# EAGLE design 1.1 (EAGLE 7.7.0)
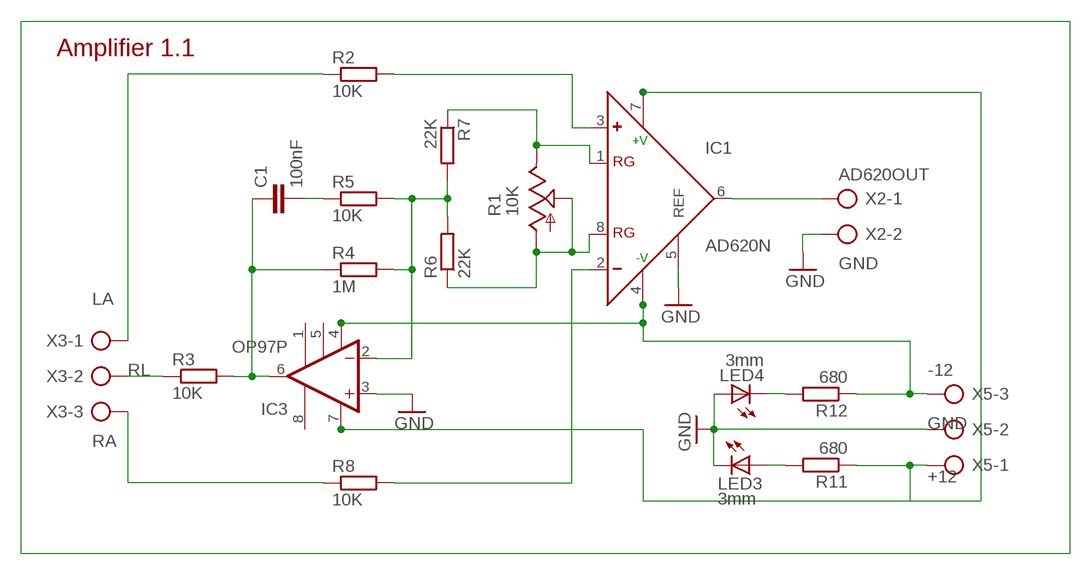
[diagram p0: schematic, sheet 1]

## Parts
C1  100nF  C-EU050-025X075  [C050-025X075]
IC1  AD620N  [DIL08]
IC3  OP97P  [DIL08]
LED3  3mm  LED5MM  [LED5MM]
LED4  3mm  LED5MM  [LED5MM]
R1  10K  TRIM_US-RJ9W  [RJ9W]
R2  10K  R-EU_0207/10  [0207/10]
R3  10K  R-EU_0207/10  [0207/10]
R4  1M  R-EU_0207/10  [0207/10]
R5  10K  R-EU_0207/10  [0207/10]
R6  22K  R-EU_0207/10  [0207/10]
R7  22K  R-EU_0207/10  [0207/10]
R8  10K  R-EU_0207/10  [0207/10]
R11  680  R-EU_0207/10  [0207/10]
R12  680  R-EU_0207/10  [0207/10]
X2  AK500/2-H  [AK500/2-H]
X3  AK500/3-H  [AK500/3-H]
X5  AK500/3-H  [AK500/3-H]

## Nets
+12: IC1.7(+V) IC3.7(V+) R11.1 X5.1
-12: IC1.4(-V) IC3.4(V-) R12.1 X5.3
AD620OUT: IC1.6(OUT) X2.1
GND: IC1.5(REF) IC3.3(+IN) LED3.K(C) LED4.A X2.2 X5.2
LA: R2.1 X3.1
N$1: IC1.1(RG) R1.E R7.1
N$2: IC3.2(-IN) R4.2 R5.2 R6.2 R7.2
N$3: IC1.8(RG) R1.A R1.S R6.1
N$4: C1.2 R5.1
N$5: C1.1 IC3.6(OUT) R3.2 R4.1
N$7: IC1.3(+) R2.2
N$8: IC1.2(-) R8.2
N$17: LED4.K(C) R12.2
N$18: LED3.A R11.2
RA: R8.1 X3.3
RL: R3.1 X3.2
Unconnected: IC3.1(BAL1) IC3.5(COMP) IC3.8(BAL2)

## Notes on the sheet
- Amplifier 1.1

## Library data of the parts
C1 = rcl:C-EU: CAPACITOR, European symbol
IC1 = analog-devices:AD620: Low Cost, Low Power, Instrumentation Amplifier Source: http://www.analog.com/UploadedFiles/Data_Sheets/37793330023930AD620_e.pdf; MF: ALTERA CORPORATION; MPN: AD620AN; OC_FARNELL: 1523782; OC_NEWARK: 05F7108
IC3 = linear:OP97: Low Power, High Precision Operational Amplifier Source: http://www.analog.com/static/imported-files/data_sheets/OP97.pdf
LED3 LED4 = led:LED: LED OSRAM: - CHIPLED LG R971, LG N971, LY N971, LG Q971, LY Q971, LO R971, LY R971 LH N974, LH R974 LS Q976, LO Q976, LY Q976 LO Q996 - Hyper CHIPLED LW Q18S LB Q993, LB Q99A, LB R99A - SideLED LS A670, LO A670, LY A670, LG A670, LP A670 LB A673, LV A673, LT A673, LW A673 LH A674 LY A675 LS A676, LA A676, LO A676, LY A676, LW A676 LS A679, LY A679, LG A679 - Hyper Micro SIDELED® LS Y876, LA Y876, LO Y876, LY Y876 LT Y87S - SmartLED LW L88C, LW L88S LB L89C, LB L89S, LG L890 LS L89K, LO L89K, LY L89K LS L896, LA L896, LO L896, LY L896 - TOPLED LS T670, LO T670, LY T670, LG T670, LP T670 LSG T670, LSP T670, LSY T670, LOP T670, LYG T670 LG T671, LOG T671, LSG T671 LB T673, LV T673, LT T673, LW T673 LH T674 LS T676, LA T676, LO T676, LY T676, LB T676, LH T676, LSB T676, LW T676 LB T67C, LV T67C, LT T67C, LS T67K, LO T67K, LY T67K, LW E67C LS E67B, LA E67B, LO E67B, LY E67B, LB E67C, LV E67C, LT E67C LW T67C LS T679, LY T679, LG T679 LS T770, LO T770, LY T770, LG T770, LP T770 LB T773, LV T773, LT T773, LW T773 LH T774 LS E675, LA E675, LY E675, LS T675 LS T776, LA T776, LO T776, LY T776, LB T776 LHGB T686 LT T68C, LB T68C - Hyper Mini TOPLED® LB M676 - Mini TOPLED Santana® LG M470 LS M47K, LO M47K, LY M47K Source: http://www.osram.convergy.de LUXEON: - LUMILED® LXK2-PW12-R00, LXK2-PW12-S00, LXK2-PW14-U00, LXK2-PW14-V00 LXK2-PM12-R00, LXK2-PM12-S00, LXK2-PM14-U00 LXK2-PE12-Q00, LXK2-PE12-R00, LXK2-PE12-S00, LXK2-PE14-T00, LXK2-PE14-U00 LXK2-PB12-K00, LXK2-PB12-L00, LXK2-PB12-M00, LXK2-PB14-N00, LXK2-PB14-P00, LXK2-PB14-Q00 LXK2-PR12-L00, LXK2-PR12-M00, LXK2-PR14-Q00, LXK2-PR14-R00 LXK2-PD12-Q00, LXK2-PD12-R00, LXK2-PD12-S00 LXK2-PH12-R00, LXK2-PH12-S00 LXK2-PL12-P00, LXK2-PL12-Q00, LXK2-PL12-R00 Source: www.luxeon.com KINGBRIGHT: KA-3528ASYC Source: www.kingbright.com
R1 = pot:TRIM_US-: POTENTIOMETER
R2-R8 R11 R12 = resistor:R-EU_: RESISTOR, European symbol
X2 = con-ptr500:AK500/2-H: CONNECTOR Aug. 2004 / PTR Meßtechnik: Die Bezeichnung der Serie AK505 wurde geändert. Es handelt sich hierbei um AK500 in horizontaler Ausführung.; OC_FARNELL: unknown; OC_NEWARK: unknown
X3 X5 = con-ptr500:AK500/3-H: CONNECTOR Aug. 2004 / PTR Meßtechnik: Die Bezeichnung der Serie AK505 wurde geändert. Es handelt sich hierbei um AK500 in horizontaler Ausführung.; OC_FARNELL: unknown; OC_NEWARK: unknown

## Board
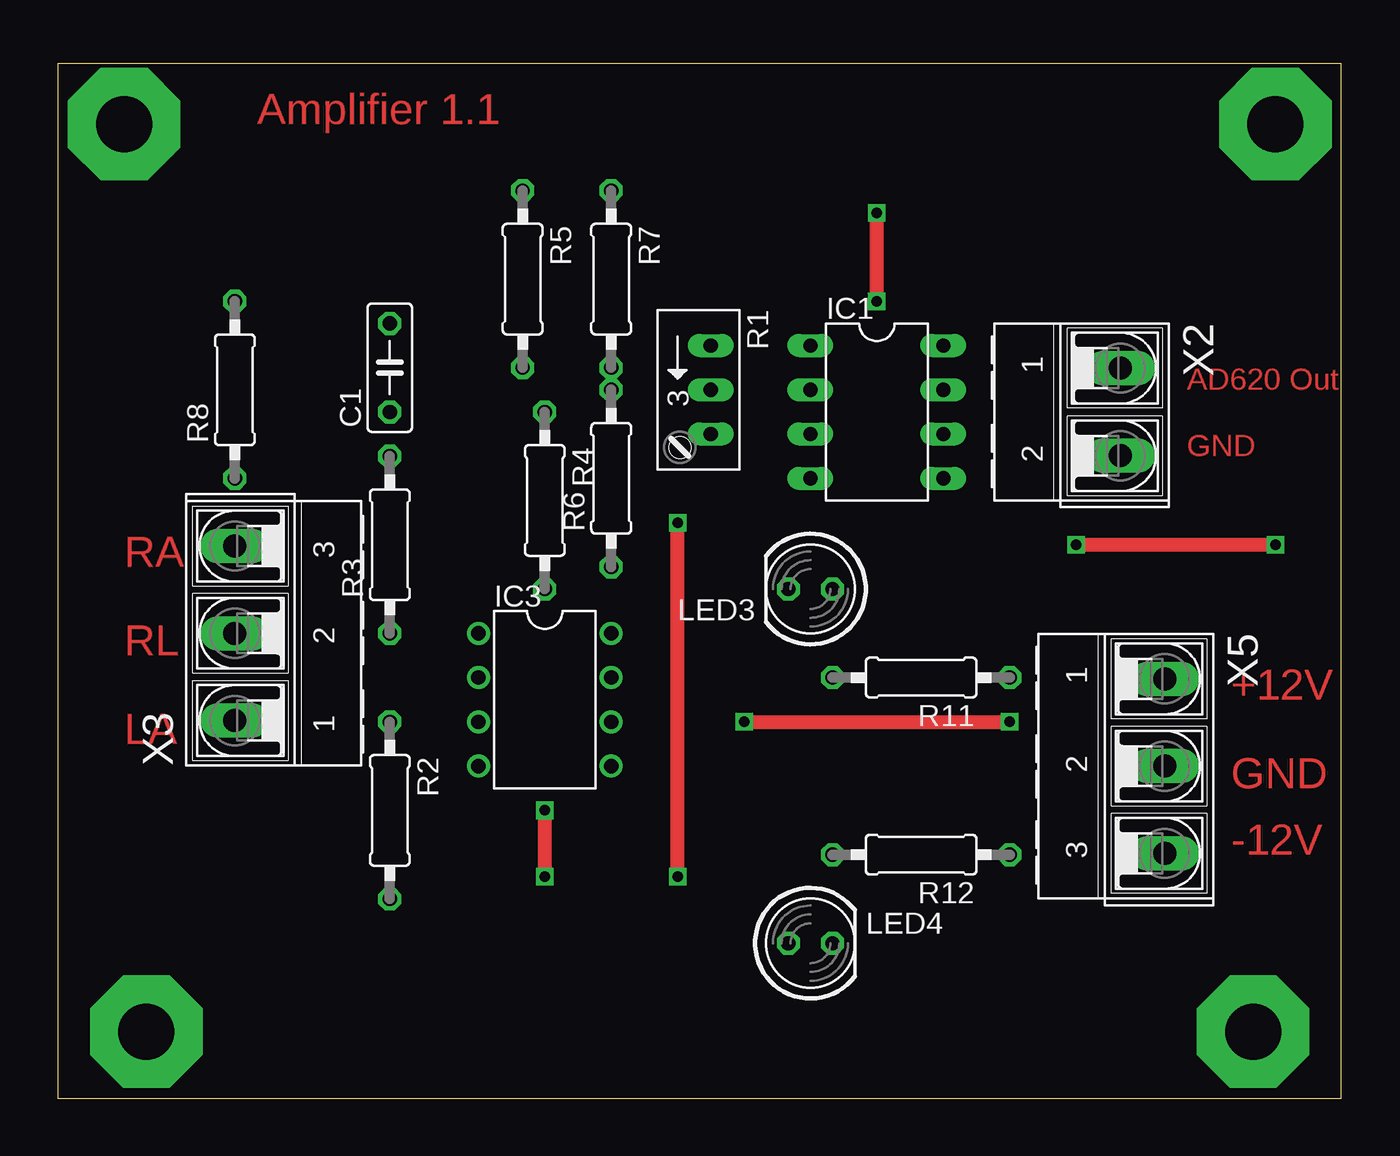
[diagram p1: board, top side]
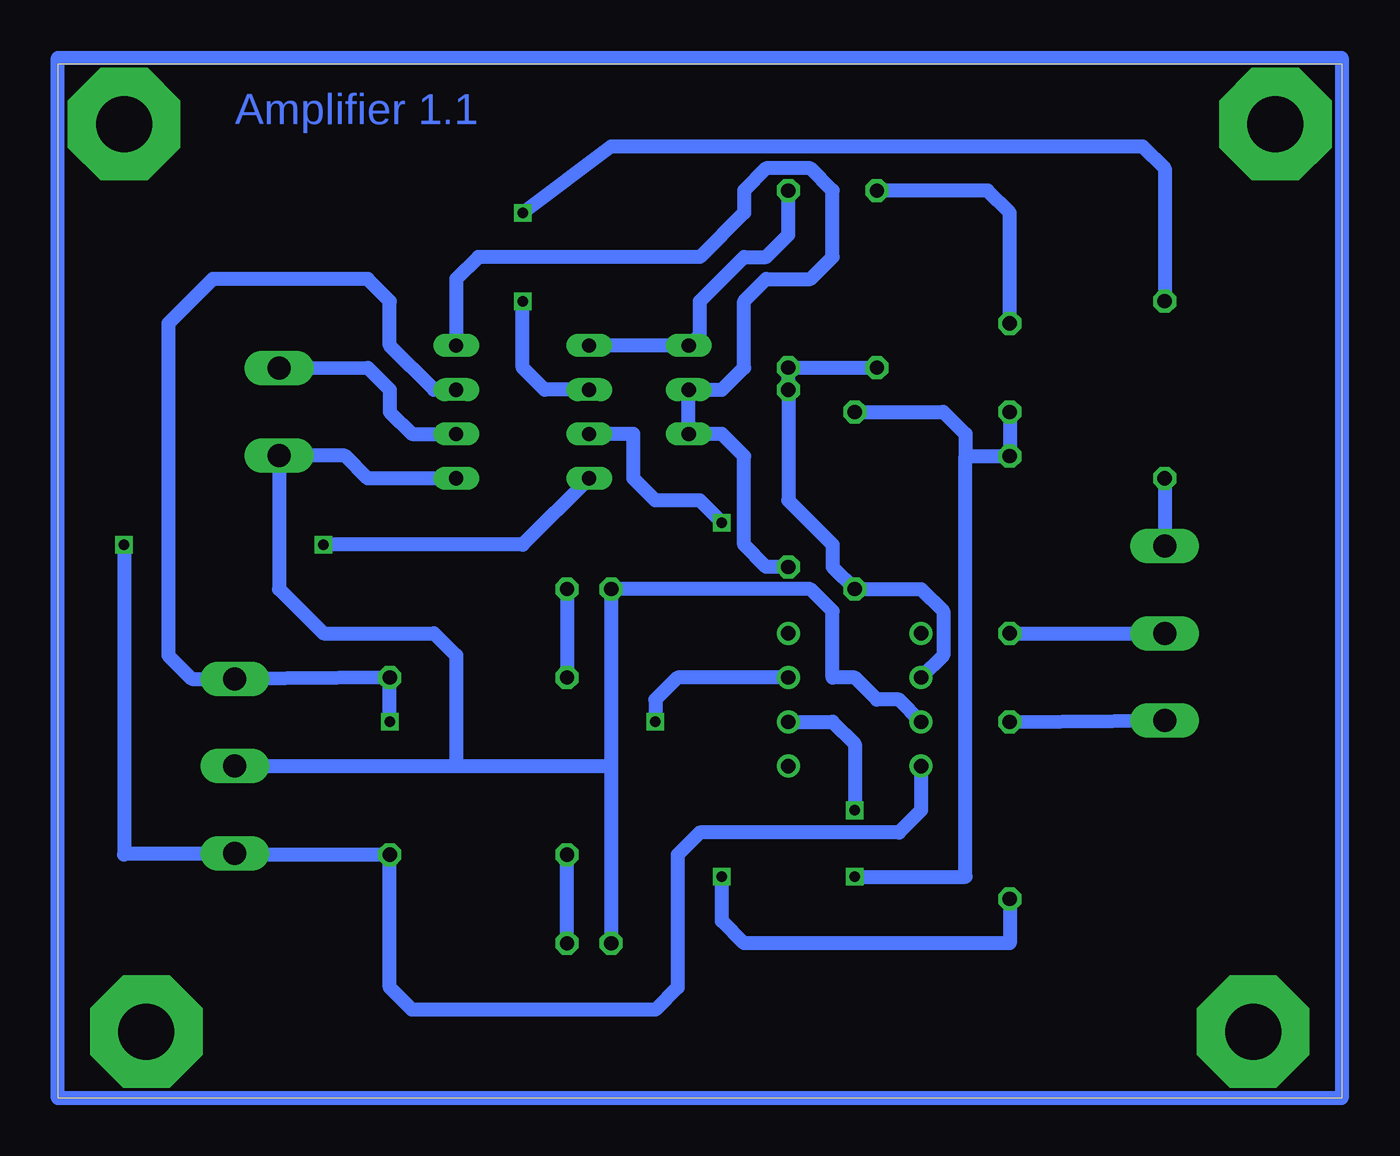
[diagram p2: board, bottom side, seen from below]

Size 73.64 x 59.36 mm. Coordinates in mm from the lower left corner, seen from the top.
Outline: 0,0 73.64,0 73.64,59.36 0,59.36 0,0
Copper layers (1*16): Top 0.035mm / dielectric 1.5mm / Bottom 0.035mm
Design rules "default": minimum track width 10mil, minimum drill 24mil, track to track 8mil, track to pad 8mil, pad to pad 8mil, via to via 8mil, smd to smd 8mil, copper to edge 40mil, drill to drill 8mil, minimum pad ring 10mil, minimum via ring 8mil, stop-mask expansion 4mil, vias tented up to drill 0mil, thermal gap 10mil

### Footprints (pad centres in the part's own frame; a part is rotated, then mirrored left to right if it is on the bottom)
C050-025X075 = drill 0.813 octagon: 1 -2.54,0; 2 2.54,0
DIL08 = drill 0.813 long: 1 -3.81,-3.81; 2 -1.27,-3.81; 3 1.27,-3.81; 4 3.81,-3.81; 5 3.81,3.81; 6 1.27,3.81; 7 -1.27,3.81; 8 -3.81,3.81
DIL08' = drill 0.813 pad 1.27: 1 -3.81,-3.81; 2 -1.27,-3.81; 3 1.27,-3.81; 4 3.81,-3.81; 5 3.81,3.81; 6 1.27,3.81; 7 -1.27,3.81; 8 -3.81,3.81
LED5MM = drill 0.813 octagon: A -1.27,0; K 1.27,0
RJ9W = drill 0.813 long: A 2.54,0.635; E -2.54,0.635; S 0,0.635
0207/10 = drill 0.813 octagon: 1 -5.08,0; 2 5.08,0
AK500/2-H = drill 1.321 long: 1 -2.515,0; 2 2.515,0
AK500/3-H = drill 1.321 long: 1 -5.004,0; 2 0,0; 3 5.004,0

### Placement (x,y rotation side)
C1  19.05,41.91 90 top
IC1  46.99,39.37 270 top
IC3  OP97P  [DIL08']  27.94,22.86 270 top
LED3  43.18,29.21 180 top
LED4  43.18,8.89 0 top
R1  36.83,40.64 270 top
R2  19.05,16.51 270 top
R3  19.05,31.75 90 top
R4  27.94,34.29 270 top
R5  26.67,46.99 270 top
R6  31.75,35.56 90 top
R7  31.75,46.99 270 top
R8  10.16,40.64 90 top
R11  49.53,24.13 180 top
R12  49.53,13.97 180 top
X2  60.96,39.37 270 top
X3  10.16,26.67 90 top
X5  63.5,19.05 270 top

### Tracks (layer width: path | path; a pad name or v marks a point on that pad's centre or on a via)
+12  (via drill 0.6)
  Top 0.813: v39.37,21.59 v54.61,21.59
  Bottom 0.813: IC1.7 52.07,40.64 54.61,43.18 54.61,45.72 55.88,46.99 64.77,46.99 67.31,44.45 67.31,25.4 65.96,24.05 X5.1 R11.1 v54.61,21.59 | IC3.7 38.1,24.13 39.37,22.86 v39.37,21.59
-12  (via drill 0.6)
  Top 0.813: v58.42,31.75 v69.85,31.75
  Bottom 0.813: IC3.4 24.13,16.51 25.4,15.24 36.83,15.24 38.1,13.97 38.1,6.35 39.37,5.08 53.34,5.08 54.61,6.35 R12.1 63.5,13.97 X5.3 69.77,14.05 69.85,13.97 v69.85,31.75 | IC1.4 46.99,31.75 v58.42,31.75
AD620OUT
  Bottom 0.813: X2.1 55.88,41.91 54.61,40.64 54.61,39.37 53.34,38.1 IC1.6
GND
  Bottom 0.813: 41.91,19.05 LED3.K 30.48,29.21 29.21,27.94 29.21,24.13 27.94,24.13 26.67,22.86 25.4,22.86 IC3.3 | 41.91,19.05 LED4.A | X5.2 50.8,19.05 | 50.8,19.05 41.91,19.05 | 50.8,19.05 50.8,25.4 52.07,26.67 58.42,26.67 60.96,29.21 X2.2 57.18,36.86 55.88,35.56 IC1.5
LA
  Bottom 0.813: R2.1 X3.1
N$1
  Bottom 0.813: IC1.1 R1.E 36.83,43.81 36.83,45.72 34.29,48.26 33.02,48.26 31.75,49.53 R7.1
N$2
  Bottom 0.813: R5.2 R7.2 R6.2 31.75,34.29 29.21,31.75 29.21,30.48 R4.2 24.13,29.21 22.86,27.94 22.86,25.4 IC3.2
N$3
  Bottom 0.813: R6.1 33.02,30.48 34.29,31.75 34.29,36.83 35.56,38.1 R1.A R1.S 35.56,40.64 34.29,41.91 34.29,45.72 33.02,46.99 30.48,46.99 29.21,48.26 29.21,52.07 30.48,53.34 33.02,53.34 34.29,52.07 34.29,50.8 36.83,48.26 49.53,48.26 50.8,46.99 IC1.8
N$4
  Bottom 0.813: C1.2 19.05,50.8 20.32,52.07 R5.1
N$5  (via drill 0.6)
  Top 0.813: v27.94,16.51 v27.94,12.7
  Bottom 0.813: C1.1 R3.2 21.59,36.83 | IC3.6 29.21,21.59 27.94,20.32 v27.94,16.51 | v27.94,12.7 21.59,12.7 21.59,36.83 | R4.1 22.86,39.37 21.59,38.1 21.59,36.83
N$6
  Bottom 0.813: 0,59.69 0,0 73.66,0 73.66,59.69 0,59.69
N$7  (via drill 0.6)
  Top 0.813: v35.56,12.7 v35.56,33.02
  Bottom 0.813: R2.2 19.05,8.89 34.29,8.89 35.56,10.16 v35.56,12.7 | v35.56,33.02 36.83,34.29 39.37,34.29 40.64,35.56 40.64,38.1 IC1.3
N$8  (via drill 0.6)
  Top 0.813: v46.99,45.72 v46.99,50.8
  Bottom 0.813: IC1.2 45.72,40.64 46.99,41.91 v46.99,45.72 | v46.99,50.8 41.91,54.61 11.43,54.61 10.16,53.34 R8.2
N$9  (via drill 3.2 pad 6.45)
  other vias: 3.81,55.88
N$10  (via drill 3.2 pad 6.45)
  other vias: 5.08,3.81
N$11  (via drill 3.2 pad 6.45)
  other vias: 68.58,3.81
N$12  (via drill 3.2 pad 6.45)
  other vias: 69.85,55.88
N$17
  Bottom 0.813: LED4.K R12.2
N$18
  Bottom 0.813: LED3.A R11.2
RA
  Bottom 0.813: R8.1 X3.3
RL
  Bottom 0.813: R3.1 X3.2

### Text on the board
Top: Amplifier 1.1 | AD620 Out | GND | RA | RL | +12V | LA | GND | -12V
Bottom: Amplifier 1.1